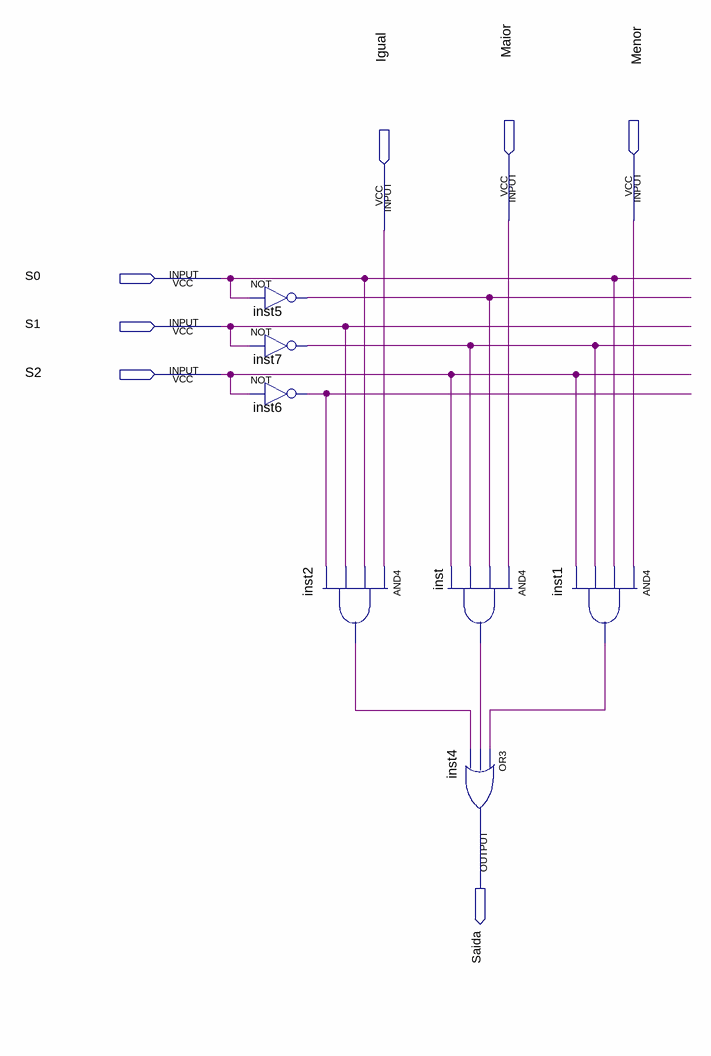
[diagram p0: schematic sheet]
// Quartus schematic Mux8_1_bit.bdf as structural Verilog: 7 symbols, 7 pins
module Mux8_1_bit (
  input  Maior,
  input  Menor,
  input  Igual,
  input  S0,
  input  S1,
  input  S2,
  output Saida
);

  wire inst1_out, inst2_out, inst5_out, inst6_out, inst7_out, inst_out;

  not inst5 (inst5_out, S0);
  not inst7 (inst7_out, S1);
  not inst6 (inst6_out, S2);
  and inst2 (inst2_out, Igual, S0, S1, inst6_out);
  and inst (inst_out, Maior, inst5_out, inst7_out, S2);
  or inst4 (Saida, inst1_out, inst_out, inst2_out);
  and inst1 (inst1_out, Menor, S0, inst7_out, S2);
endmodule
